# Altium project LPGDetA1.PrjPCB (part 2 of 2)

## Sheet LPGDetA1_mech.SchDoc
size A4; DocumentNumber: 6; SheetNumber: 6; SheetTotal: 6; Subtitle0: Elementy mechaniczne; LotOfPieces: 1; SVNPath: SVNPath
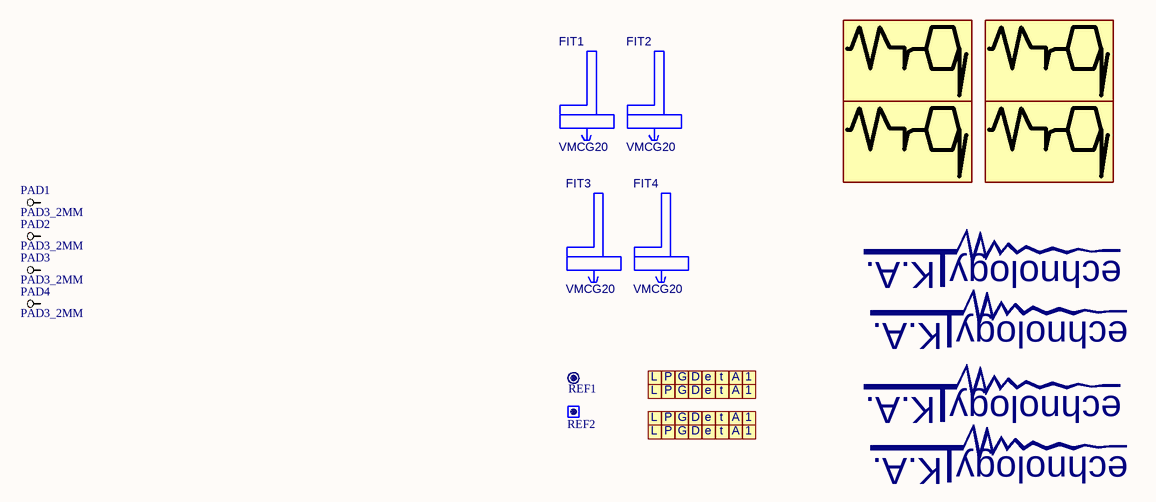
[diagram p4: LPGDetA1_mech.SchDoc]

### Parts
(Parts that share a designator on the sheet are numbered #1, #2 ... from top to bottom, then left to right.)
?#5  (no value)
FIT1  VMCG20  [VMCG20]
FIT2  VMCG20  [VMCG20]
FIT3  VMCG20  [VMCG20]
FIT4  VMCG20  [VMCG20]
LETTER1  LETTERC_L  [LETTERC_L_60_10_TL]  (value not drawn)  (no BOM)
LETTER2  LETTERC_P  [LETTERC_P_60_10_TL]  (value not drawn)  (no BOM)
LETTER3  LETTERC_G  [LETTERC_G_60_10_TL]  (value not drawn)  (no BOM)
LETTER4  LETTERC_D  [LETTERC_D_60_10_TL]  (value not drawn)  (no BOM)
LETTER5  LETTER_E  [LETTER_E_60_10_TL]  (value not drawn)  (no BOM)
LETTER6  LETTER_T  [LETTER_T_60_10_TL]  (value not drawn)  (no BOM)
LETTER7  LETTERC_A  [LETTERC_A_60_10_TL]  (value not drawn)  (no BOM)
LETTER8  LETTER_1  [LETTER_1_60_10_TL]  (value not drawn)  (no BOM)
LETTER9  LETTERC_L  [LETTERC_L_60_20_TS]  (value not drawn)  (no BOM)
LETTER10  LETTERC_P  [LETTERC_P_60_20_TS]  (value not drawn)  (no BOM)
LETTER11  LETTERC_G  [LETTERC_G_60_20_TS]  (value not drawn)  (no BOM)
LETTER12  LETTERC_D  [LETTERC_D_60_20_TS]  (value not drawn)  (no BOM)
LETTER13  LETTER_E  [LETTER_E_60_20_TS]  (value not drawn)  (no BOM)
LETTER14  LETTER_T  [LETTER_T_60_20_TS]  (value not drawn)  (no BOM)
LETTER15  LETTERC_A  [LETTERC_A_60_20_TS]  (value not drawn)  (no BOM)
LETTER16  LETTER_1  [LETTER_1_60_20_TS]  (value not drawn)  (no BOM)
LETTER17  LETTERC_L  [LETTERC_L_60_10_TL]  (value not drawn)  (no BOM)
LETTER18  LETTERC_P  [LETTERC_P_60_10_TL]  (value not drawn)  (no BOM)
LETTER19  LETTERC_G  [LETTERC_G_60_10_TL]  (value not drawn)  (no BOM)
LETTER20  LETTERC_D  [LETTERC_D_60_10_TL]  (value not drawn)  (no BOM)
LETTER21  LETTER_E  [LETTER_E_60_10_TL]  (value not drawn)  (no BOM)
LETTER22  LETTER_T  [LETTER_T_60_10_TL]  (value not drawn)  (no BOM)
LETTER23  LETTERC_A  [LETTERC_A_60_10_TL]  (value not drawn)  (no BOM)
LETTER24  LETTER_1  [LETTER_1_60_10_TL]  (value not drawn)  (no BOM)
LETTER25  LETTERC_L  [LETTERC_L_60_20_TS]  (value not drawn)  (no BOM)
LETTER26  LETTERC_P  [LETTERC_P_60_20_TS]  (value not drawn)  (no BOM)
LETTER27  LETTERC_G  [LETTERC_G_60_20_TS]  (value not drawn)  (no BOM)
LETTER28  LETTERC_D  [LETTERC_D_60_20_TS]  (value not drawn)  (no BOM)
LETTER29  LETTER_E  [LETTER_E_60_20_TS]  (value not drawn)  (no BOM)
LETTER30  LETTER_T  [LETTER_T_60_20_TS]  (value not drawn)  (no BOM)
LETTER31  LETTERC_A  [LETTERC_A_60_20_TS]  (value not drawn)  (no BOM)
LETTER32  LETTER_1  [LETTER_1_60_20_TS]  (value not drawn)  (no BOM)
LOGO1  MRQ_2_8  [MRQ_2_8_TL]  (value not drawn)  (no BOM)
LOGO2  MRQ_2_8  [MRQ_2_8_TL]  (value not drawn)  (no BOM)
LOGO3  MRQ_2_8  [MRQ_2_16_TS]  (value not drawn)  (no BOM)
LOGO4  MRQ_2_8  [MRQ_2_16_TS]  (value not drawn)  (no BOM)
LOGO5  KATECHNOLOGYLOGO  [KATECHNOLOGYLOGO_TL]  (value not drawn)  (no BOM)
LOGO6  KATECHNOLOGYLOGO  [KATECHNOLOGYLOGO_TS]  (value not drawn)  (no BOM)
LOGO7  KATECHNOLOGYLOGO  [KATECHNOLOGYLOGO_TL]  (value not drawn)  (no BOM)
LOGO8  KATECHNOLOGYLOGO  [KATECHNOLOGYLOGO_TS]  (value not drawn)  (no BOM)
PAD1  PAD3_2MM  [PAD3_2MM]  (no BOM)
PAD2  PAD3_2MM  [PAD3_2MM]  (no BOM)
PAD3  PAD3_2MM  [PAD3_2MM]  (no BOM)
PAD4  PAD3_2MM  [PAD3_2MM]  (no BOM)
REF1  REF_CIR  [REF_CIR]  (value not drawn)  (no BOM)
REF2  REF_REC  [REF_REC]  (value not drawn)  (no BOM)

### Nets

Not connected (* = marked no-connect by the designer): PAD1 1; PAD2 1; PAD3 1; PAD4 1

### Notes on the sheet
- K.A.
- echnology
- Wariant:
- Projekt i wykonanie: Miroslaw Lach MRQ, www.mrq-ml.com
- "AMPROJECT" Andrzej Maciejak
- SVNPath:
- Page:
- Rev.
- /
- File name:
- (in symbol KATechnologyLogo[[/\]]KATECHLOGO) K.A.; echnology
- (in symbol LETTER_1[[/\]]LETTER_1) 1
- (in symbol LETTER_E[[/\]]LETTER_E) e
- (in symbol LETTER_T[[/\]]LETTER_T) t
- (in symbol LETTERC_A[[/\]]LETTER_A) A
- (in symbol LETTERC_D[[/\]]LETTER_D) D
- (in symbol LETTERC_G[[/\]]LETTER_G) G
- (in symbol LETTERC_L[[/\]]LETTER_L) L
- (in symbol LETTERC_P[[/\]]LETTER_P) P

### Library data of the parts
?#5 = KATECHNOLOGYLOGO
FIT1-FIT4 = VMCG20[[/\]]VMCG20: Reference5: Adsys; Typ5: Richco plastic; Currency5: 0,6800; Amount5: PLN; Value: VMCG20; Dimensions: VMCG20; Supplier5: wspornik plytki drukowanej; Manufacturer5: VMCG20; Price1: 41251
LETTER1 LETTER9 LETTER17 LETTER25 = LETTERC_L[[/\]]LETTER_L: Value: LETTERC_L; Dimensions: LETTER_L
LETTER2 LETTER10 LETTER18 LETTER26 = LETTERC_P[[/\]]LETTER_P: Value: LETTERC_P; Dimensions: LETTER_P
LETTER3 LETTER11 LETTER19 LETTER27 = LETTERC_G[[/\]]LETTER_G: Value: LETTERC_G; Dimensions: LETTER_G
LETTER4 LETTER12 LETTER20 LETTER28 = LETTERC_D[[/\]]LETTER_D: Value: LETTERC_D; Dimensions: LETTER_D
LETTER5 LETTER13 LETTER21 LETTER29 = LETTER_E[[/\]]LETTER_E: Value: LETTER_E; Dimensions: LETTER_E
LETTER6 LETTER14 LETTER22 LETTER30 = LETTER_T[[/\]]LETTER_T: Value: LETTER_T; Dimensions: LETTER_T
LETTER7 LETTER15 LETTER23 LETTER31 = LETTERC_A[[/\]]LETTER_A: Value: LETTERC_A; Dimensions: LETTER_A
LETTER8 LETTER16 LETTER24 LETTER32 = LETTER_1[[/\]]LETTER_1: Value: LETTER_1; Dimensions: LETTER_1
LOGO1-LOGO4 = MRQ_2_8[[/\]]MRQLOGO: Value: MRQ_2_8; Dimensions: MRQLOGO
LOGO5-LOGO8 = KATechnologyLogo[[/\]]KATECHLOGO: Value: KATechnologyLogo; Dimensions: KATECHLOGO
PAD1-PAD4 = PAD3_2MM[[/\]]PAD3_2MM: Value: PAD3_2MM; Dimensions: PAD3_2MM
REF1 = REF_CIR[[/\]]REF_CIR: Punkt referencyjny dla  płyty używany przez FLX2010; Descript: Reference point; Value: REF_CIR; Dimensions: REF_CIR
REF2 = REF_REC[[/\]]REF_REC: Punkt referencyjny dla  płyty używany przez FLX2010; Descript: Reference point; Value: REF_REC; Dimensions: REF_REC

## Sheet LPGDetA1_rel.SchDoc
size A4; DocumentNumber: 2; SheetNumber: 2; SheetTotal: 6; Subtitle0: Subtitle0; Subtitle1: Subtitle1; Subtitle2: Subtitle2; LotOfPieces: 1; SVNPath: SVNPath
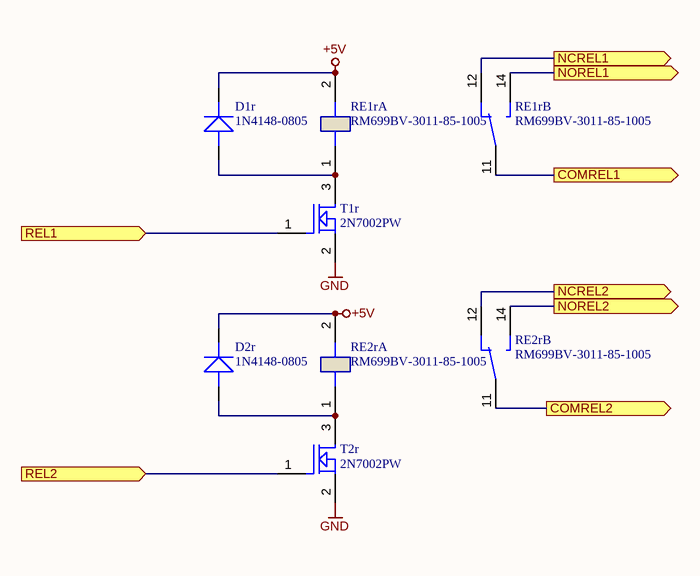
[diagram p5: LPGDetA1_rel.SchDoc]

### Parts
(Parts that share a designator on the sheet are numbered #1, #2 ... from top to bottom, then left to right.)
?#6  (no value)
D1r  1N4148-0805  [D0805]
D2r  1N4148-0805  [D0805]
RE1r  RM699BV-3011-85-1005  [RM699BV]  (parts A,B of 2)
RE2r  RM699BV-3011-85-1005  [RM699BV]  (parts A,B of 2)
T1r  2N7002PW  [SOT323-3_FLOW]
T2r  2N7002PW  [SOT323-3_FLOW]

### Ports
COMREL1, COMREL2, NCREL1, NCREL2, NOREL1, NOREL2, REL1, REL2

### Nets
+5V: D1r.CATH D2r.CATH RE1r.2(A2) RE2r.2(A2)
GND: T1r.2(SOURCE) T2r.2(SOURCE)
COMREL1: RE1r.11 ; port COMREL1
COMREL2: RE2r.11 ; port COMREL2
NCREL1: RE1r.12 ; port NCREL1
NCREL2: RE2r.12 ; port NCREL2
NOREL1: RE1r.14 ; port NOREL1
NOREL2: RE2r.14 ; port NOREL2
REL1: T1r.1(GATE) ; port REL1
REL2: T2r.1(GATE) ; port REL2
NetD1r_ANOD: D1r.ANOD RE1r.1(A1) T1r.3(DRAIN)
NetD2r_ANOD: D2r.ANOD RE2r.1(A1) T2r.3(DRAIN)

### Notes on the sheet
- K.A.
- echnology
- Wariant:
- Projekt i wykonanie: Miroslaw Lach MRQ, www.mrq-ml.com
- "AMPROJECT" Andrzej Maciejak
- SVNPath:
- Page:
- Rev.
- /
- File name:

### Library data of the parts
?#6 = KATECHNOLOGYLOGO
D1r D2r = 1N4148-0805[[/\]]D0805: Descript: Small signal diode; Currency5: PLZ; Amount5: 25+; Value: 1N4148-0805; Dimensions: D0805; Supplier5: tme.pl; Reference5: 1N4148-0805; Price5: 0,084; DateOfPrice5: 2012-09-21; Price1: 0,052
RE1r RE2r = RM699BV-3011-85-1005[[/\]]28x5x15: Descript: Przekaznik miniaturowy pionowy 6A/250VAC, cewka 5VDC; Reference5: RM699V-P-05; Currency5: PLN; Amount5: 1; Value: RM699BV-3011-85-1005; Dimensions: 28x5x15; ComponentLink1Description: Datasheet; ComponentLink1URL: http://www.mrq-ml.com/Parts/Relays/rm699b.pdf; Supplier5: tme.pl; Manufacturer5: Relpol; Typ5: RM699BV-3011-85-1005; Price5: 11,1; DateOfPrice5: 2012-10-28
T1r T2r = 2N7002PW[[/\]]SOT323-3: Descript: N-channel enhacement-mode vertical DMOS FET; Reference5: 1829184; Currency5: PLN; Amount5: 1+; Value: 2N7002PW; Dimensions: SOT323-3; ComponentLink1Description: Datasheet; ComponentLink1URL: http://www.mrq-ml.com/Parts/Transistors/2N7002PW.pdf; Supplier5: farnell.com; Price5: 0,17; DateOfPrice5: 2012-09-19; Manufacturer5: NXP; Typ5: 2N7002PW; Price1: 0,14

## Nets that join several sheets
+2V: LPGDetA1_main (J1.7), LPGDetA1_supply (C9u.1 R2u.1 U4u.2)
+3V3: LPGDetA1_main (J1.6), LPGDetA1_cpu (17 pins), LPGDetA1_supply (C7u.1 U3u.2), LPGDetA1_out (C4o.1 SW1o.3 SW1o.4 U2o.5)
+5V: LPGDetA1_main (J1.5 J8.1 J9.1 M1.2), LPGDetA1_cpu (C15c.1 U4c.1), LPGDetA1_supply (6 pins), LPGDetA1_out (R8o.1), LPGDetA1_rel (D1r.CATH D2r.CATH RE1r.2 RE2r.2)
+9V: LPGDetA1_supply (5 pins), LPGDetA1_out (R7o.2)
GND: LPGDetA1_main (6 pins), LPGDetA1_cpu (27 pins), LPGDetA1_supply (15 pins), LPGDetA1_out (8 pins), LPGDetA1_rel (T1r.2 T2r.2)
AUX0: LPGDetA1_main (M1.8), LPGDetA1_cpu (U1c.26)
C-IN: LPGDetA1_supply (L3u.2), LPGDetA1_out (R9o.2 R10o.1 R13o.2)
C-OUT: LPGDetA1_supply (L2u.2), LPGDetA1_out (C2o.2 D1o.CATH)
COMREL1: LPGDetA1_main (J2.3 J2.4), LPGDetA1_rel (RE1r.11)
COMREL2: LPGDetA1_main (J3.3 J3.4), LPGDetA1_rel (RE2r.11)
CURR-SOURCE-IN: LPGDetA1_cpu (U1c.19), LPGDetA1_out (R11o.1 U2o.1)
CURR-SOURCE-OUT: LPGDetA1_cpu (U1c.14), LPGDetA1_out (U1o.5)
DIN: LPGDetA1_main (M1.7), LPGDetA1_cpu (U1c.25)
GAS-CONC: LPGDetA1_main (J1.3), LPGDetA1_cpu (U1c.10)
NCREL1: LPGDetA1_main (J2.1 J2.2), LPGDetA1_rel (RE1r.12)
NCREL2: LPGDetA1_main (J3.5 J3.6), LPGDetA1_rel (RE2r.12)
NOREL1: LPGDetA1_main (J2.5 J2.6), LPGDetA1_rel (RE1r.14)
NOREL2: LPGDetA1_main (J3.1 J3.2), LPGDetA1_rel (RE2r.14)
OFFSET-ADJ: LPGDetA1_main (J1.4), LPGDetA1_cpu (U1c.15)
PIEZO: LPGDetA1_main (T1.1), LPGDetA1_cpu (U1c.46)
REL1: LPGDetA1_cpu (U1c.33), LPGDetA1_rel (T1r.1)
REL2: LPGDetA1_cpu (U1c.27), LPGDetA1_rel (T2r.1)
RS485-APLUS: LPGDetA1_main (5 pins), LPGDetA1_cpu (J2c.2 U3c.6)
RS485-BMINUS: LPGDetA1_main (5 pins), LPGDetA1_cpu (J4c.2 U3c.7)
S-IN: LPGDetA1_main (D4.CATH J7.3 J7.4), LPGDetA1_supply (L3u.1)
S-OUT: LPGDetA1_main (D5.CATH J6.3 J6.4), LPGDetA1_supply (L2u.1)
SCLK: LPGDetA1_main (M1.6), LPGDetA1_cpu (U1c.28)
SUPP-NEG: LPGDetA1_main (13 pins), LPGDetA1_supply (L1u.3 L1u.4)
SUPP-POS: LPGDetA1_main (9 pins), LPGDetA1_supply (L1u.1 L1u.2)
SYNC: LPGDetA1_main (M1.5), LPGDetA1_cpu (U1c.32)
USART2RXD: LPGDetA1_main (M1.4 R2.2), LPGDetA1_cpu (U1c.13)
USART2TXD: LPGDetA1_main (M1.3 R1.2), LPGDetA1_cpu (U1c.12)

## Assembly variants
4-20mA: not fitted D1 D1r D2 D2r J1 J2 J2 J2c J3 J4c J5c J8 J9 M1 R1 R1u R2 R7o R11c RE1r RE2r T1 T1r T2r U3c
4-20mA_bez 78M09: not fitted D1 D1r D2 D2r J1 J2 J2 J2c J3 J4c J5c J8 J9 M1 R1 R2 R7o R11c RE1r RE2r T1 T1r T2r U1u U3c